# EAGLE design shield (EAGLE 6.3)
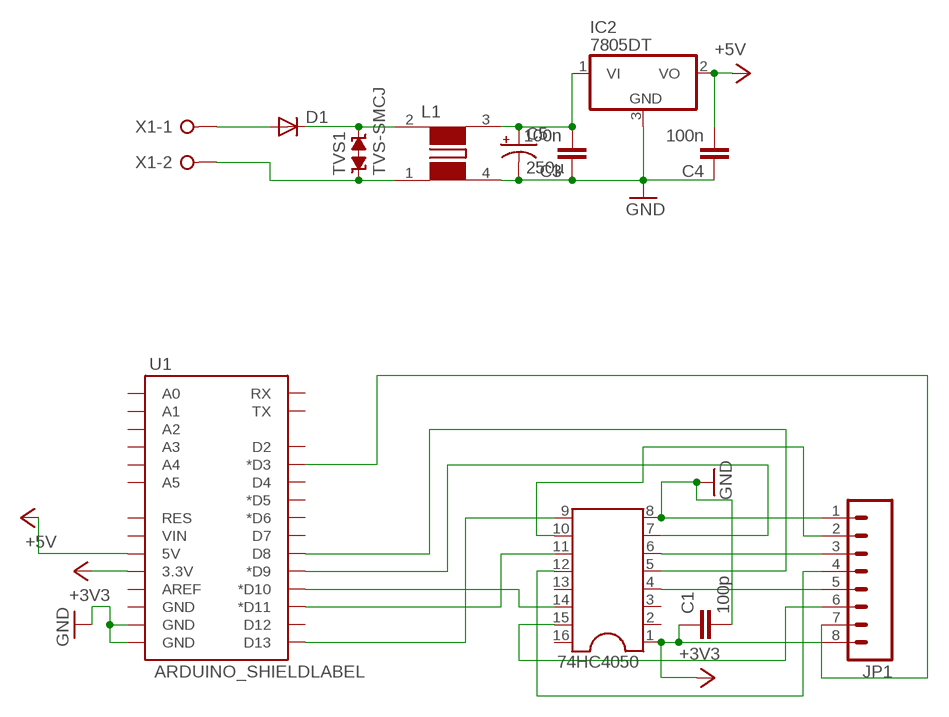
[diagram p0: schematic, sheet 1]

## Parts
74HC4050  DIL16  [DIL16]
C1  100p  C-EUC0603K  [C0603K]
C3  100n  C-EUC1206K  [C1206K]
C4  100n  C-EUC1206K  [C1206K]
C5  250µ  CAP_POLH13  [PANASONIC_H13]
D1  DIODE-DO-214AC  [DO-214AC]
IC2  7805DT  [TO252]
JP1  M083.5MM-8  [SCREWTERMINAL-3.5MM-8]
L1  WE-SL2  [WE-SL2_74422...]
TVS1  TVS-SMCJ  [SMCJ]
U1  ARDUINO_SHIELDLABEL  [DUEMILANOVE_SHIELD]
X1  W237-02P  [W237-132]

## Nets
+3V3: 74HC4050.1 C1.1 JP1.8 U1.3.3V
+5V: C4.2 IC2.2(VO) U1.5V
GND: 74HC4050.8 C1.2 C3.1 C4.1 C5.- IC2.3(GND) JP1.1 L1.4 U1.GND@0(GND) U1.GND@1(GND)
N$1: 74HC4050.9 U1.D13
N$2: 74HC4050.11 U1.D11(*D11)
N$3: 74HC4050.14 U1.D10(*D10)
N$4: C3.2 C5.+ IC2.1(VI) L1.3
N$5: 74HC4050.7 U1.D9(*D9)
N$6: D1.C L1.2 TVS1.C
N$7: 74HC4050.5 U1.D8
N$8: 74HC4050.10 JP1.2
N$9: D1.A X1.1
N$10: L1.1 TVS1.A X1.2
N$11: 74HC4050.6 JP1.3
N$12: 74HC4050.12 JP1.4
N$13: 74HC4050.4 JP1.5
N$14: 74HC4050.15 JP1.6
N$15: JP1.7 U1.D3(*D3)
Unconnected: 74HC4050.2 74HC4050.3 74HC4050.13 74HC4050.16 U1.A0 U1.A1 U1.A2 U1.A3 U1.A4 U1.A5 U1.AREF U1.D2 U1.D4 U1.D5(*D5) U1.D6(*D6) U1.D7 U1.D12 U1.GND@2(GND) U1.RES U1.RX U1.TX U1.VIN

## Library data of the parts
74HC4050 = ic-package:DIL16: Dual In Line / Socket
C1 C3 C4 = rcl:C-EU: CAPACITOR, European symbol
C5 = SparkFun:CAP_POL: Capacitor Polarized These are standard SMD and PTH capacitors. Normally 10uF, 47uF, and 100uF in electrolytic and tantalum varieties. Always verify the external diameter of the through hole cap, it varies with capacity, voltage, and manufacturer. The EIA devices should be standard.
D1 = diode:DIODE-: DIODE
IC2 = linear:78*: Positive VOLTAGE REGULATOR Source: http://cache.national.com/ds/LM/LM78L05.pdf http://www.fairchildsemi.com/ds/LM/LM7805.pdf
JP1 = SparkFun:M08: Header 8 Standard 8-pin 0.1" header. Use with straight break away headers (SKU : PRT-00116), right angle break away headers (PRT-00553), swiss pins (PRT-00743), machine pins (PRT-00117), and female headers (PRT-00115).
L1 = wuerth-elektronik:WE-SL2: SMD Common-Mode Choke for signal lines WE-SL2 For distortion-free removal of noise from transmitted electrical signals - Double current-compensated choke -- Current compensated choke for data and signal lines -- Power supply systems -- Filter for measurement signals
TVS1 = supressor:TVS-: TVS BI-DIRECTIONAL
U1 = SparkFun:ARDUINO_SHIELD
X1 = con-wago-508:W237-02P: WAGO SREW CLAMP; OC_FARNELL: unknown; OC_NEWARK: unknown

## Board
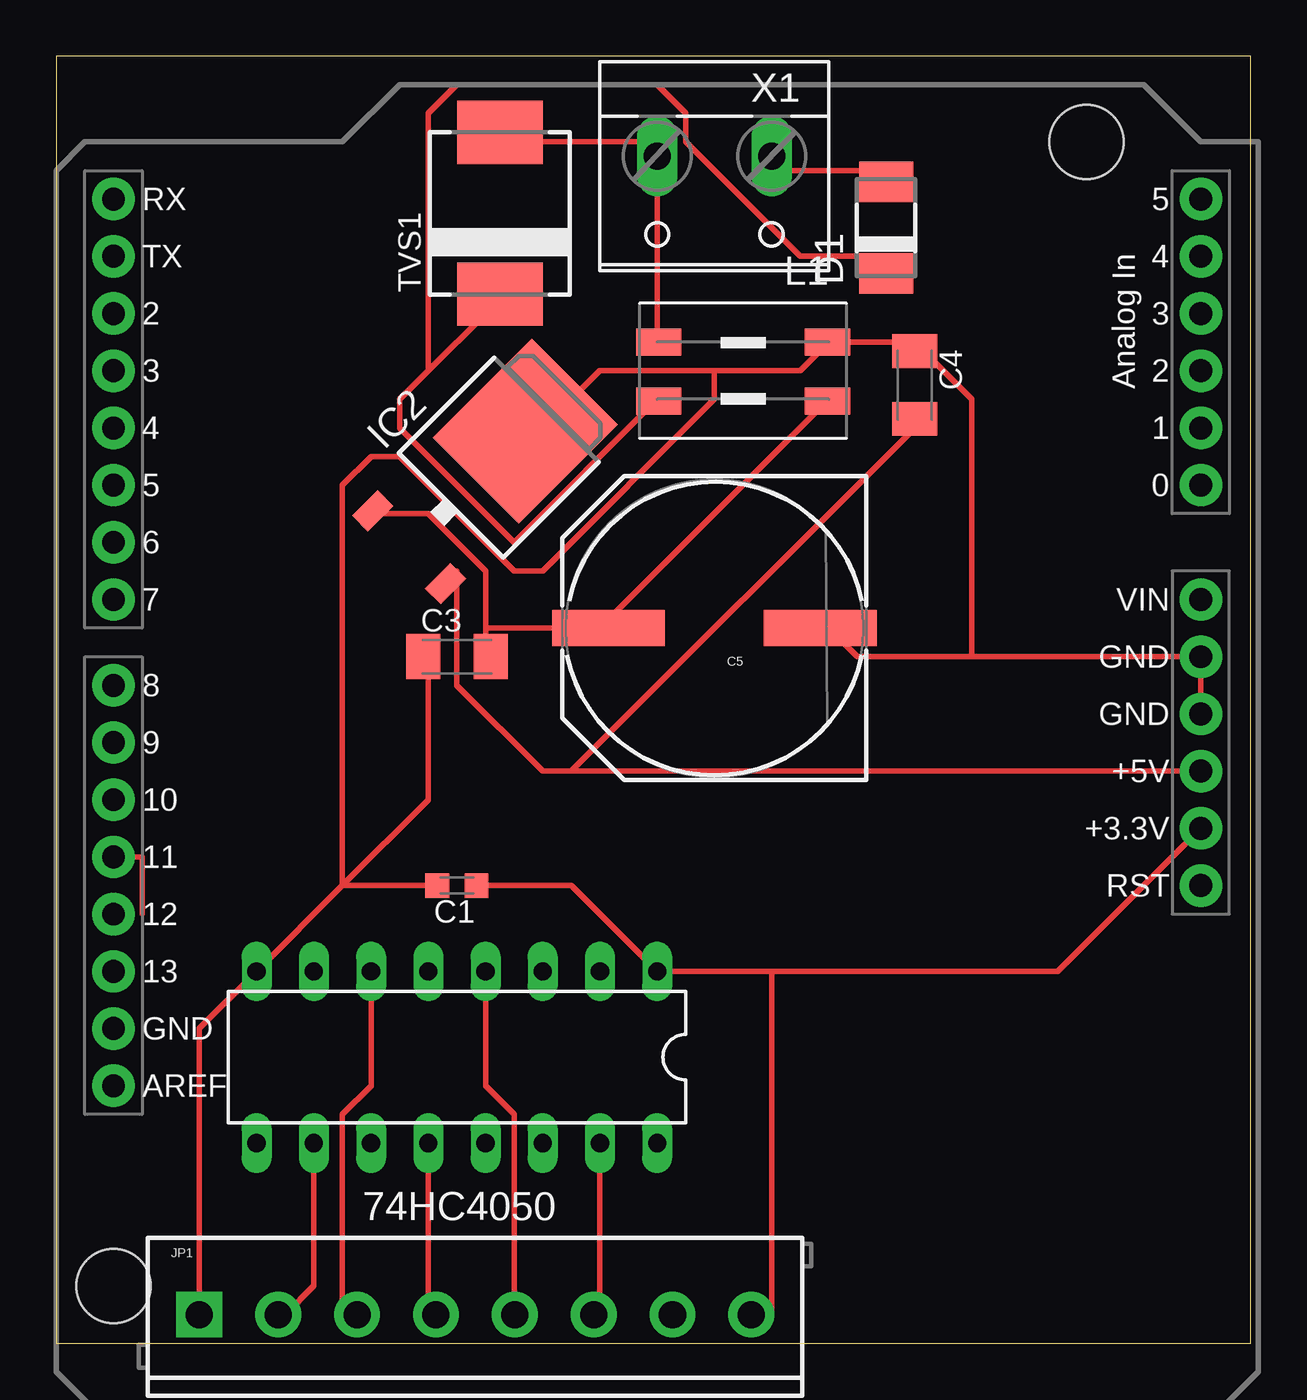
[diagram p1: board, top side]
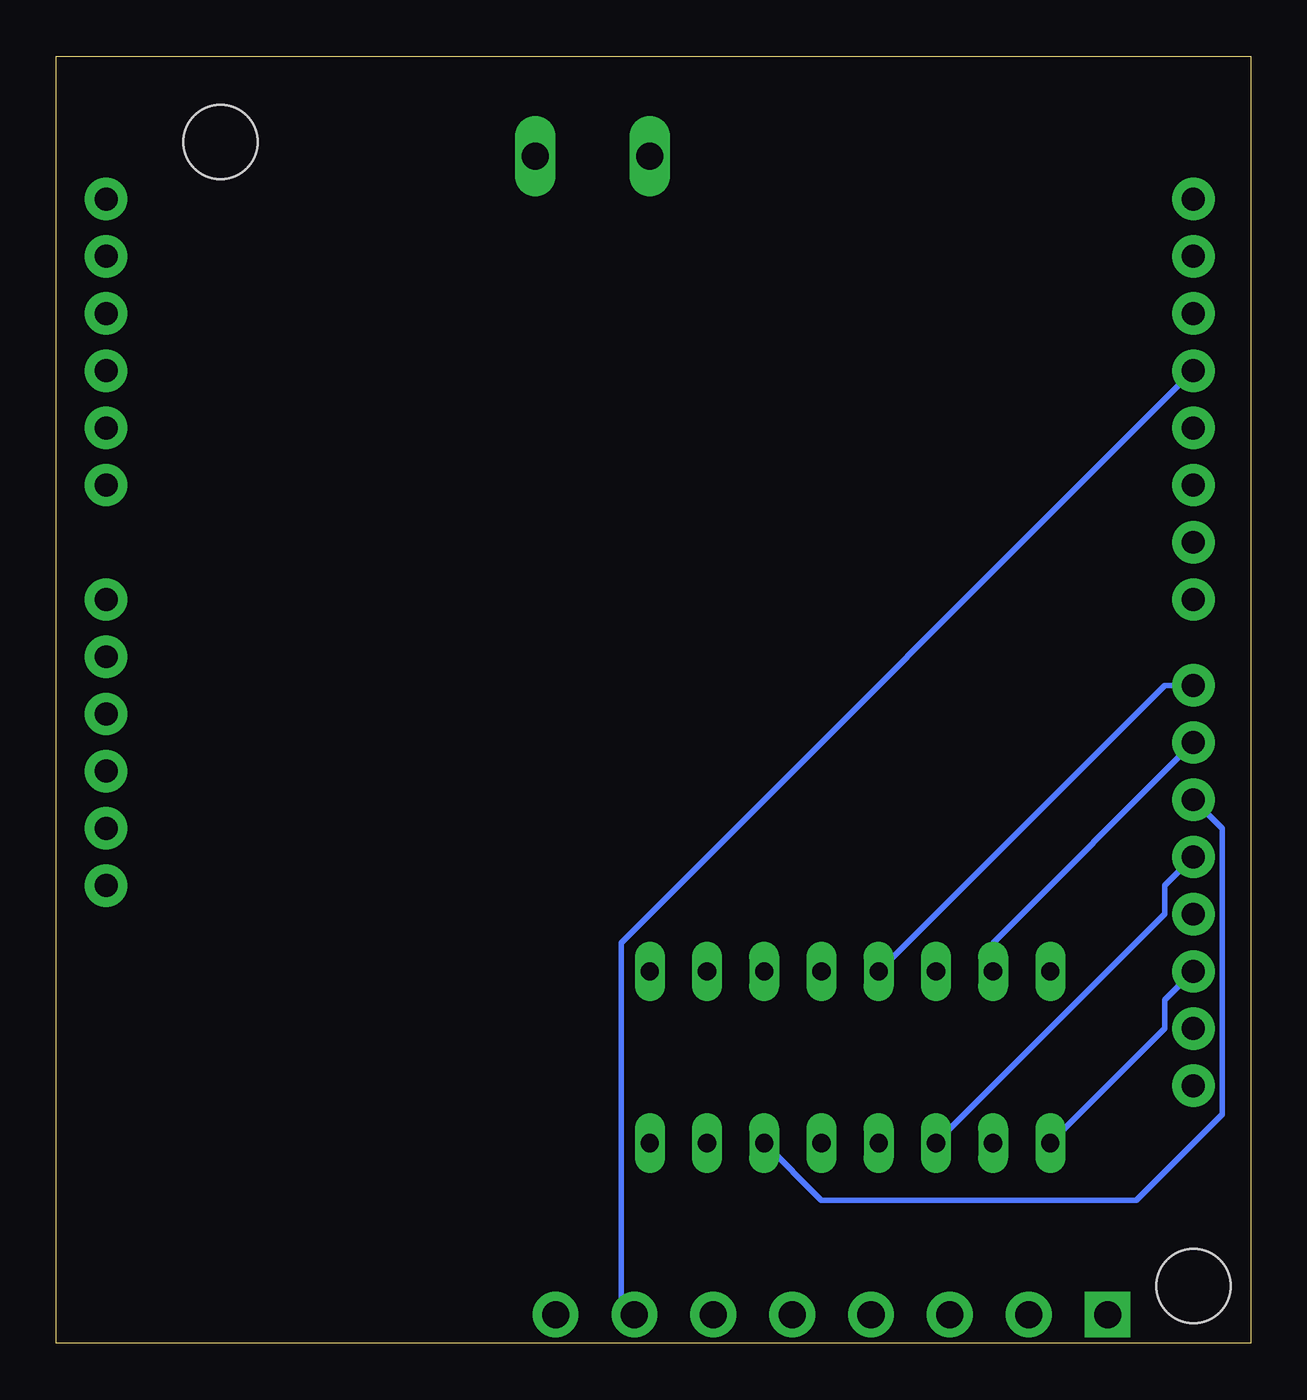
[diagram p2: board, bottom side, seen from below]

Size 53.01 x 57.14 mm. Coordinates in mm from the lower left corner, seen from the top.
Outline: 0,0 53.01,0 53.01,57.14 0,57.14 0,0
Copper layers (1*16): Top 0.035mm / dielectric 1.5mm / Bottom 0.035mm
Design rules "default": minimum track width 10mil, minimum drill 24mil, track to track 8mil, track to pad 8mil, pad to pad 8mil, via to via 8mil, smd to smd 8mil, copper to edge 40mil, drill to drill 8mil, minimum pad ring 10mil, minimum via ring 8mil, stop-mask expansion 4mil, vias tented up to drill 0mil, thermal gap 10mil

### Footprints (pad centres in the part's own frame; a part is rotated, then mirrored left to right if it is on the bottom)
DIL16 = drill 0.813 long: 1 -8.89,-3.81; 2 -6.35,-3.81; 3 -3.81,-3.81; 4 -1.27,-3.81; 5 1.27,-3.81; 6 3.81,-3.81; 7 6.35,-3.81; 8 8.89,-3.81; 9 8.89,3.81; 10 6.35,3.81; 11 3.81,3.81; 12 1.27,3.81; 13 -1.27,3.81; 14 -3.81,3.81; 15 -6.35,3.81; 16 -8.89,3.81
C0603K = smd 1.05 x 1.08: 1 -0.875,0; 2 0.875,0
C1206K = smd 1.5 x 2: 1 -1.5,0; 2 1.5,0
PANASONIC_H13 = smd 5 x 1.6: + 4.7,0; - -4.7,0
DO-214AC = smd 1.8 x 2.4: A 2.025,0; C -2.025,0
TO252 = smd 1 x 1.6: 1 -2.28,-4.8; 2 2.28,-4.8 | smd 5.4 x 6.2: 3 0,2.5
SCREWTERMINAL-3.5MM-8 = drill 1.2 pad 2.032 square: 1 0,0 | drill 1.2 pad 2.032: 2 3.5,0; 3 7,0; 4 10.5,0; 5 14,0; 6 17.5,0; 7 21,0; 8 24.5,0
WE-SL2_74422... = smd 2 x 1.2: 1 -3.75,1.27; 2 -3.75,-1.34; 3 3.75,-1.34; 4 3.75,1.27
SMCJ = smd 2.8 x 3.8: A 3.592,0; C -3.592,0
DUEMILANOVE_SHIELD = drill 1.016 pad 1.88: 3.3V 50.8,26.67; 5V 50.8,29.21; A0 50.8,41.91; A1 50.8,44.45; A2 50.8,46.99; A3 50.8,49.53; A4 50.8,52.07; A5 50.8,54.61; AREF 2.54,15.24; D2 2.54,49.53; D3 2.54,46.99; D4 2.54,44.45; D5 2.54,41.91; D6 2.54,39.37; D7 2.54,36.83; D8 2.54,33.02; D9 2.54,30.48; D10 2.54,27.94; D11 2.54,25.4; D12 2.54,22.86; D13 2.54,20.32; GND@0 50.8,31.75; GND@1 50.8,34.29; GND@2 2.54,17.78; RES 50.8,24.13; RX 2.54,54.61; TX 2.54,52.07; VIN 50.8,36.83 | hole 3.302: 45.72,57.15; 2.54,6.35
W237-132 = drill 1.194 long: 1 -2.54,-0.635; 2 2.54,-0.635

### Placement (x,y rotation side)
74HC4050  17.78,12.7 180 top
C1  17.78,20.32 180 top
C3  17.78,30.48 0 top
C4  38.1,42.55 270 top
C5  29.21,31.75 180 top
D1  36.83,49.53 90 top
IC2  19.05,38.73 315 top
JP1  6.35,1.27 0 top
L1  30.48,43.18 0 top
TVS1  19.68,50.16 90 top
U1  0,-3.81 0 top
X1  29.21,52.07 180 top

### Tracks (layer width: path | path; a pad name or v marks a point on that pad's centre or on a via)
+3V3
  Top 0.254: 31.75,16.51 44.45,16.51 U1.3.3V | 31.75,16.51 74HC4050.1 22.86,20.32 19.05,20.32 C1.1 | 31.75,16.51 31.75,1.27 JP1.8
+5V
  Top 0.254: U1.5V 22.86,25.4 | 22.86,25.4 21.59,25.4 17.78,29.21 17.78,34.29 IC2.2 | 22.86,25.4 38.1,40.64 C4.2
GND
  Top 0.254: U1.GND@0 U1.GND@1 40.64,30.48 | 38.1,44.45 34.29,44.45 | 34.29,44.45 L1.4 34.29,44.45 | 38.1,44.45 C4.1 38.1,44.45 | 34.29,44.45 33.02,43.18 29.21,43.18 | 29.21,43.18 24.13,43.18 21.59,40.64 IC2.3 | 40.64,30.48 35.56,30.48 34.29,31.75 C5.- | 40.64,30.48 40.64,41.91 38.1,44.45 | 12.7,20.32 74HC4050.8 6.35,13.97 JP1.1 | 12.7,20.32 16.51,24.13 16.51,30.48 C3.1 | 29.21,43.18 29.21,41.91 21.59,34.29 20.32,34.29 15.24,39.37 13.97,39.37 12.7,38.1 12.7,20.32 | 12.7,20.32 16.51,20.32 C1.2
N$1
  Bottom 0.254: 74HC4050.9 3.81,13.97 3.81,15.24 U1.D13
N$2
  Top 0.254: 3.81,19.05 3.81,21.59 U1.D11
  Bottom 0.254: 74HC4050.11 3.81,19.05 3.81,20.32 U1.D11
N$3
  Bottom 0.254: 74HC4050.14 19.05,6.35 5.08,6.35 1.27,10.16 1.27,22.86 U1.D10
N$4
  Top 0.254: 19.05,31.75 19.05,30.48 C3.2 | 19.05,31.75 19.05,34.29 16.51,36.83 13.97,36.83 IC2.1 | 24.13,31.75 34.29,41.91 L1.3 | 24.13,31.75 C5.+ 24.13,31.75 | 24.13,31.75 19.05,31.75
N$5
  Bottom 0.254: 74HC4050.7 11.43,17.78 U1.D9
N$6
  Top 0.254: 16.51,43.18 19.05,45.72 TVS1.C | 16.51,43.18 15.24,41.91 15.24,40.64 20.32,35.56 26.67,41.91 L1.2 | 16.51,43.18 16.51,54.61 17.78,55.88 26.67,55.88 27.94,54.61 27.94,53.34 33.02,48.26 36.83,48.26 D1.C
N$7
  Bottom 0.254: 74HC4050.5 3.81,29.21 U1.D8
N$8
  Top 0.254: 74HC4050.10 11.43,2.54 10.16,1.27 JP1.2
N$9
  Top 0.254: D1.A 36.83,52.07 31.75,52.07 X1.1
N$10
  Top 0.254: L1.1 26.67,44.45 26.67,52.07 X1.2 26.67,53.34 20.32,53.34 TVS1.A
N$11
  Top 0.254: 74HC4050.6 13.97,11.43 12.7,10.16 12.7,1.27 JP1.3
N$12
  Top 0.254: 74HC4050.12 16.51,1.27 JP1.4
N$13
  Top 0.254: 74HC4050.4 19.05,11.43 20.32,10.16 20.32,1.27 JP1.5
N$14
  Top 0.254: 74HC4050.15 24.13,1.27 JP1.6
N$15
  Bottom 0.254: U1.D3 27.94,17.78 27.94,1.27 JP1.7